# Altium schematic sheet HotSwap.SchDoc
size A4; SheetNumber: 2; SheetTotal: 2
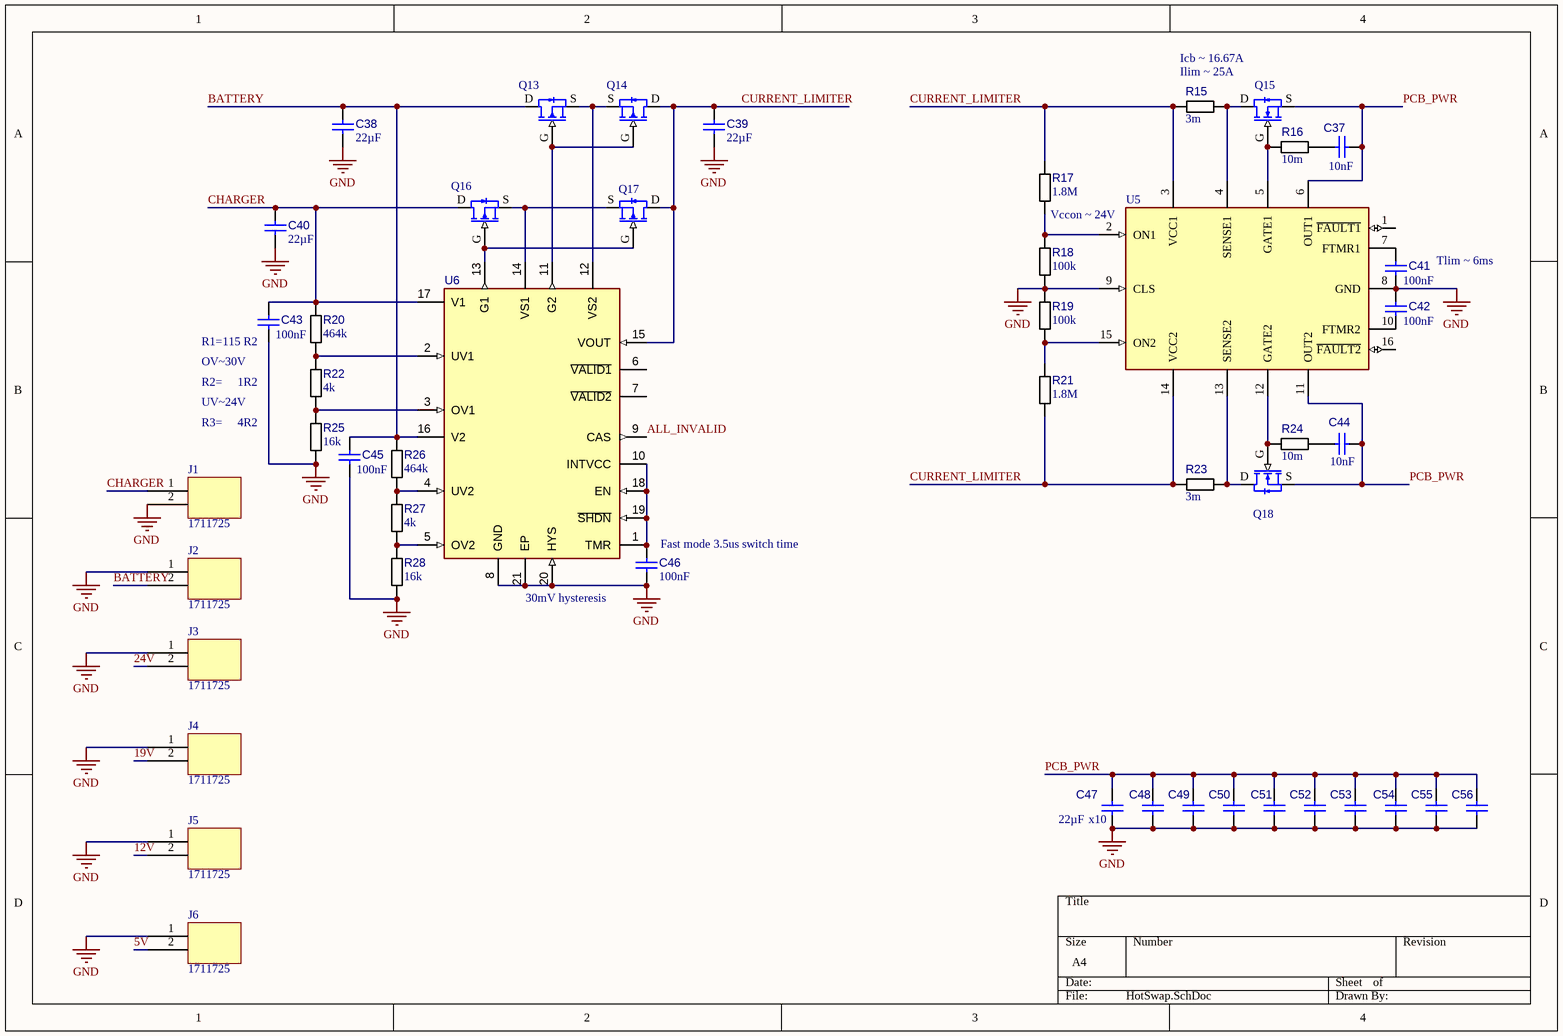
[diagram p0: HotSwap.SchDoc]

## Parts
C37  value 10nF  [CAPC1608X10N]  (hidden comment: CL10B103JB8NNNC)
C38  value 22µF  [CAPC5750X31N]  (hidden comment: FS55X226K500EHG)
C39  value 22µF  [CAPC5750X31N]  (hidden comment: FS55X226K500EHG)
C40  value 22µF  [CAPC5750X31N]  (hidden comment: FS55X226K500EHG)
C41  value 100nF  [CAPC1608X10N]  (hidden comment: 100nF 0603)
C42  value 100nF  [CAPC1608X10N]  (hidden comment: 100nF 0603)
C43  value 100nF  [CAPC1608X10N]  (hidden comment: 100nF 0603)
C44  value 10nF  [CAPC1608X10N]  (hidden comment: CL10B103JB8NNNC)
C45  value 100nF  [CAPC1608X10N]  (hidden comment: 100nF 0603)
C46  value 100nF  [CAPC1608X10N]  (hidden comment: 100nF 0603)
C47  value 22µF  [CAPC5750X31N]  (hidden comment: FS55X226K500EHG)
C48  FS55X226K500EHG  [CAPC5750X31N]  (value not drawn)
C49  FS55X226K500EHG  [CAPC5750X31N]  (value not drawn)
C50  FS55X226K500EHG  [CAPC5750X31N]  (value not drawn)
C51  FS55X226K500EHG  [CAPC5750X31N]  (value not drawn)
C52  FS55X226K500EHG  [CAPC5750X31N]  (value not drawn)
C53  FS55X226K500EHG  [CAPC5750X31N]  (value not drawn)
C54  FS55X226K500EHG  [CAPC5750X31N]  (value not drawn)
C55  FS55X226K500EHG  [CAPC5750X31N]  (value not drawn)
C56  FS55X226K500EHG  [CAPC5750X31N]  (value not drawn)
J1  1711725  [1711725-Footprint-1]
J2  1711725  [1711725-Footprint-1]
J3  1711725  [1711725-Footprint-1]
J4  1711725  [1711725-Footprint-1]
J5  1711725  [1711725-Footprint-1]
J6  1711725  [1711725-Footprint-1]
Q13  MOSFET P-channel  [DPAK200P800X170-5N]  (value not drawn)
Q14  MOSFET P-channel  [DPAK200P800X170-5N]  (value not drawn)
Q15  IPT007N06NATMA1  [INF-PG-HSOF-8-1_V]  (value not drawn)
Q16  MOSFET P-channel  [DPAK200P800X170-5N]  (value not drawn)
Q17  MOSFET P-channel  [DPAK200P800X170-5N]  (value not drawn)
Q18  IPT007N06NATMA1  [INF-PG-HSOF-8-1_V]  (value not drawn)
R15  value 3m  [RESC6432X09N]  (hidden comment: HoLLR2512-3W-3mR-1%)
R16  value 10m  [RESC6432X09N]  (hidden comment: HOJLR2512-3W-10MR-1%)
R17  value 1.8M  [RESC1608X06N]  (hidden comment: 0603WAF1804T5E)
R18  value 100k  [RESC1608X06N]  (hidden comment: 100k 0603)
R19  value 100k  [RESC1608X06N]  (hidden comment: 100k 0603)
R20  value 464k  [RESC1608X06N]  (hidden comment: 0603WAF4643T5E)
R21  value 1.8M  [RESC1608X06N]  (hidden comment: 0603WAF1804T5E)
R22  value 4k  [RESC1608X06N]  (hidden comment: ARG03FTC4001N)
R23  value 3m  [RESC6432X09N]  (hidden comment: HoLLR2512-3W-3mR-1%)
R24  value 10m  [RESC6432X09N]  (hidden comment: HOJLR2512-3W-10MR-1%)
R25  value 16k  [RESC1608X06N]  (hidden comment: RC0603FR-0716KL)
R26  value 464k  [RESC1608X06N]  (hidden comment: 0603WAF4643T5E)
R27  value 4k  [RESC1608X06N]  (hidden comment: ARG03FTC4001N)
R28  value 16k  [RESC1608X06N]  (hidden comment: RC0603FR-0716KL)
U5  LTC4226IMS-2#TRPBF  [FP-MS-16-05-08-1669-IPC_B]  (value not drawn)
U6  LTC4418IUF  [ADI-UF-20_V]  (value not drawn)

## Nets
GND: C38.1 C39.1 C40.1 C41.2 C42.1 C43.2 C45.2 C46.2 C47.1 C48.1 C49.1 C50.1 C51.1 C52.1 C53.1 C54.1 C55.1 C56.1 J1.2(GND) J2.1(PWR) J3.1(PWR) J4.1(PWR) J5.1(PWR) J6.1(PWR) R18.1 R19.1 R25.1 R28.1 U5.8(GND) U5.9(CLS) U6.8(GND) U6.20(HYS) U6.21(EP)
5V: J6.2(GND)
12V: J5.2(GND)
19V: J4.2(GND)
24V: J3.2(GND)
ALL_INVALID: U6.9(CAS)
BATTERY: C38.2 C45.1 J2.2(GND) Q13.D R26.2 U6.16(V2)
CHARGER: C40.2 C43.1 J1.1(PWR) Q16.D R20.2 U6.17(V1)
CURRENT_LIMITER: C39.2 Q14.D Q17.D R15.1 R17.2 R21.1 R23.1 U5.3(VCC1) U5.14(VCC2) U6.15(VOUT)
PCB_PWR: C37.2 C44.2 C47.2 C48.2 C49.2 C50.2 C51.2 C52.2 C53.2 C54.2 C55.2 C56.2 Q15.S Q18.S U5.6(OUT1) U5.11(OUT2)
NetC37_1: C37.1 R16.2
NetC41_1: C41.1 U5.7(FTMR1)
NetC42_2: C42.2 U5.10(FTMR2)
NetC44_1: C44.1 R24.2
NetC46_1: C46.1 U6.1(TMR) U6.10(INTVCC) U6.18(EN) U6.19(~{SHDN})
NetQ13_G: Q13.G Q14.G U6.11(G2)
NetQ13_S: Q13.S Q14.S U6.12(VS2)
NetQ15_D: Q15.D R15.2 U5.4(SENSE1)
NetQ15_G: Q15.G R16.1 U5.5(GATE1)
NetQ16_G: Q16.G Q17.G U6.13(G1)
NetQ16_S: Q16.S Q17.S U6.14(VS1)
NetQ18_D: Q18.D R23.2 U5.13(SENSE2)
NetQ18_G: Q18.G R24.1 U5.12(GATE2)
NetR17_1: R17.1 R18.2 U5.2(ON1)
NetR19_2: R19.2 R21.2 U5.15(ON2)
NetR20_1: R20.1 R22.2 U6.2(UV1)
NetR22_1: R22.1 R25.2 U6.3(OV1)
NetR26_1: R26.1 R27.2 U6.4(UV2)
NetR27_1: R27.1 R28.2 U6.5(OV2)

Not connected (* = marked no-connect by the designer): U5 1(~{FAULT1}) 16(~{FAULT2}); U6 6(~{VALID1}) 7(~{VALID2})

## Notes on the sheet
- Icb ~ 16.67A
- Ilim ~ 25A
- Vccon ~ 24V
- Tlim ~ 6ms
- (near C43) R1=115 R2
- R2=     1R2
- (near C43) OV~30V
- R3=     4R2
- UV~24V
- (near C46) Fast mode 3.5us switch time
- 30mV hysteresis
- (near C47) x10

## Library data of the parts
C37 C44 = CMP-001-00110-2: Ceramic Capacitor, Multilayer, Ceramic, 50V, 5% +Tol, 5% -Tol, X7R, 15% TC, 0.01uF, Surface Mount, 0603; Tolerance  (fill in as +-): 5%; Reach SVHC Compliant: Yes; Max Operating Temperature: 125°C; Length: 1.6mm; Capacitor Type: Ceramic; Case/Package: 0603; Temperature Characteristics Code: X7R; Height: 0.9mm; RoHS Compliant: Yes; Pins: 2; Tolerance (fill in as +-): 5%; Mounting Technology: Surface Mount; Rated DC Voltage (URdc): 50V; Min Operating Temperature: -55°C
C38-C40 C47 = CMP-001-00107-1: 50V 22uF X7R ±10% 2220  Multilayer Ceramic Capacitors MLCC - SMD/SMT ROHS; Capacitor Type: Ceramic; ComponentLink1URL: https://jlcpcb.com/partdetail/839503-FS55X226K500EHG/C784103; Voltage Rating: 50V; Mounting Technology: SMD; Tolerance: 10%; Case/Package: 2220; ComponentLink1Description: JLCPCB; Pins: 2
C41-C43 C45 C46 = CMP-001-00096-5: Ceramic Capacitor, Multilayer, Ceramic, 50V, 5% +Tol, 5% -Tol, X7R, 15% TC, 0.1uF, Surface Mount, 0603; Voltage Rating: 100V; ComponentLink1Description: JLCPCB; Max Operating Temperature: 125°C; Pins: 2; Min Operating Temperature: -55°C; ComponentLink2URL: https://jlcpcb.com/api/file/downloadByFileSystemAccessId/8563426422237782016; ComponentLink2Description: Datasheet; Mounting Technology: SMD; Case/Package: 0603; Capacitor Type: Ceramic; RoHS Compliant: Yes; Tolerance: 5%; ComponentLink1URL: https://jlcpcb.com/partdetail/25192-CL10B104JB8NNNC/C24452
C48-C56 = CMP-001-00107-1: 50V 22uF X7R ±10% 2220  Multilayer Ceramic Capacitors MLCC - SMD/SMT ROHS; Value: 22µF; Capacitor Type: Ceramic; ComponentLink1URL: https://jlcpcb.com/partdetail/839503-FS55X226K500EHG/C784103; Voltage Rating: 50V; Mounting Technology: SMD; Tolerance: 10%; Case/Package: 2220; ComponentLink1Description: JLCPCB; Pins: 2
J1-J6 = CMP-002-00071-8: Barrier Strip Terminal Block, 24A, 2.5mm2, 1 Row(s), 1 Deck(s); Wire/Cable Gauge: 12AWG; Fastening Method: SCREW; Voltage Rating: 400V; Current Rating: 24A; Mounting Technology: Board; RoHS Compliant: Yes
Q13 Q14 Q16 Q17 = CMP-013-00037-4: Power MOSFET, P Channel, 40 V, 390 A, 0.0014 ohm, PowerPAK, Surface Mount; Production ID: SQJQ141EL-T1_GE3; Power: 600W; ComponentLink2Description: Datasheet; Mounting Technology: SMD; ComponentLink1Description: Farnell; Max Operating Temperature: 175°C; Min Operating Temperature: -55°C; Pins: 4; ComponentLink2URL: http://www.farnell.com/datasheets/3296212.pdf; Case/Package: PowerPAK; Transistor Type: P-channel; ComponentLink1URL: https://ee.farnell.com/vishay/sqjq141el-t1-ge3/mosfet-p-ch-40v-390a-powerpak/dp/3777512
Q15 Q18 = CMP-013-00042-2: Power Field-Effect Transistor, 52A I(D), 60V, 0.00075ohm, 1-Element, N-Channel, Silicon, Metal-oxide Semiconductor FET; Case Connection: DRAIN; Avalanche Energy Rating (Eas): 1100mJ; Drain-source On Resistance-Max: 0.75mR; Pulsed Drain Current-Max (IDM): 1.2kA; Operating Mode: ENHANCEMENT MODE; Polarity/Channel Type: N-CHANNEL; Surface Mount: Yes; RoHS Compliant: Yes; Drain Current-Max (ID): 52A; ComponentLink1Description: JLCPCB; ComponentLink1URL: https://jlcpcb.com/partdetail/InfineonTechnologies-IPT007N06N/C122552; DS Breakdown Voltage-Min: 60V; Pins: 2
R15 R23 = CMP-009-00201-3: 3W 3mΩ Chip Current Sensing Resistors ±50ppm/℃ ±1% 2512  Current Sense Resistors / Shunt Resistors ROHS; ComponentLink2URL: https://wmsc.lcsc.com/wmsc/upload/file/pdf/v2/lcsc/2204121445_Milliohm-HoLLR2512-3W-3mR-1-_C2994641.pdf; Case/Package: 2512; Tolerance: 1%; Mounting Technology: SMD; Power: 3W; ComponentLink2Description: Datasheet; Pins: 2; ComponentLink1Description: JLCPCB; ComponentLink1URL: https://jlcpcb.com/partdetail/Milliohm-HoLLR2512_3W_3mR_1/C2994641
R16 R24 = CMP-009-00212-3: 3W 10mΩ Solder Pad Current Sensing Resistors ±1% 2512 Current Sense Resistors / Shunt Resistors ROHS; Case/Package: 2512; Pins: 2; Tolerance: 1%; Power: 3W; Mounting Technology: SMD; ComponentLink1Description: JLCPCB; ComponentLink1URL: https://jlcpcb.com/partdetail/Milliohm-HoJLR2512_3W_10mR_1/C2903468
R17 R21 = CMP-009-00208-3: Fixed Resistor, Metal Glaze/thick Film, 0.1W, 1800000ohm, 50V, 1% +/-Tol, 100ppm/Cel, Surface Mount, 0603; Power: 100mW; Pins: 2; Case/Package: 0603; Tolerance: 1%; Mounting Technology: SMD; Voltage Rating: 50V; ComponentLink1Description: JLCPCB; ComponentLink1URL: https://jlcpcb.com/partdetail/13965-0603WAF1804T5E/C13318; ComponentLink2URL: https://jlcpcb.com/api/file/downloadByFileSystemAccessId/8586177284231876608; ComponentLink2Description: Datasheet
R18 R19 = CMP-009-00184-4: 100mW Thick Film Resistors 75V ±100ppm/℃ ±1% 100kΩ 0603 Chip Resistor - Surface Mount ROHS; Production ID: ERJ3EKF1003V; Package Width: 0.8mm; Package Length: 1.6mm; Package Height: 0.45mm; Voltage Rating: 75V; Max Operating Temperature: 155°C; ComponentLink2URL: https://www.lcsc.com/datasheet/lcsc_datasheet_1809281124_YAGEO-RC0603FR-07100KL_C14675.pdf; Case/Package: 0603; Power: 100mW; ComponentLink2Description: Datasheet; Tolerance: 1%; Pins: 2; Mounting Technology: SMD; Min Operating Temperature: -55°C; RoHS Compliant: Yes; ComponentLink1URL: https://jlcpcb.com/partdetail/Yageo-RC0603FR07100KL/C14675; ComponentLink1Description: JLCPCB
R20 R26 = CMP-009-00209-2: 100mW Thick Film Resistors 75V ±100ppm/℃ ±1% 464kΩ 0603 Chip Resistor - Surface Mount ROHS; Voltage Rating: 75V; Pins: 2; Tolerance: 1%; RoHS Compliant: Y; Power: 100mW; Mounting Technology: SMD
R22 R27 = CMP-009-00210-2: Thin Film Resistor ±1% 4kΩ 0603  Chip Resistor - Surface Mount ROHS; Voltage Rating: 75V; Mounting Technology: SMD; Pins: 2; ComponentLink1Description: JLCPCB; Tolerance: 1%; ComponentLink2Description: Datasheet; ComponentLink1URL: https://jlcpcb.com/partdetail/VikingTech-ARG03FTC4001N/C2984443; Case/Package: 0603; ComponentLink2URL: https://wmsc.lcsc.com/wmsc/upload/file/pdf/v2/lcsc/2208091800_Viking-Tech-ARG03FTC4001N_C2984443.pdf
R25 R28 = CMP-009-00211-2: Fixed Resistor, Metal Glaze/thick Film, 0.1W, 16000ohm, 75V, 1% +/-Tol, 100ppm/Cel, Surface Mount, 0603; Power: 100mW; Package Height: 0.45mm; Package Width: 0.8mm; Package Length: 1.6mm; Construction: Chip; Working Voltage: 75V; Tolerance: 1%; Case/Package: 0603; ComponentLink1URL: https://jlcpcb.com/partdetail/Yageo-RC0603FR0716KL/C137788; Pins: 2; Min Operating Temperature: -55°C; ComponentLink2Description: Datasheet; Mounting Technology: Surface Mount; Voltage Rating: 75V; Max Operating Temperature: 155°C; RoHS Compliant: Yes; ComponentLink2URL: https://www.lcsc.com/datasheet/lcsc_datasheet_2304140030_YAGEO-RC0603FR-0716KL_C137788.pdf; ComponentLink1Description: JLCPCB
U5 = CMP-031-00007-7: Power Supply Support Circuit, Adjustable, 2 Channel, CMOS, PDSO16; Adjustable Threshold: Yes; Min Supply Voltage: 4.5V; Max Supply Voltage: 44V; Min Operating Temperature: -40°C; Height - Seated (Max): 1.1mm; Case/Package: TSSOP; Technology: CMOS; Temperature Grade: INDUSTRIAL; Max Operating Temperature: 85°C; Pins: 16; Surface Mount: Yes; RoHS Compliant: Yes
U6 = CMP-019-00046-7: Prioritized 2:1 PowerPath™ Controller, 2.5 to 40 V, -40 to 85 degC, 20-Pin QFN, RoHS; Case/Package: QFN; Pins: 21